# Altium schematic sheet LED Readout Resistors.SchDoc
size B
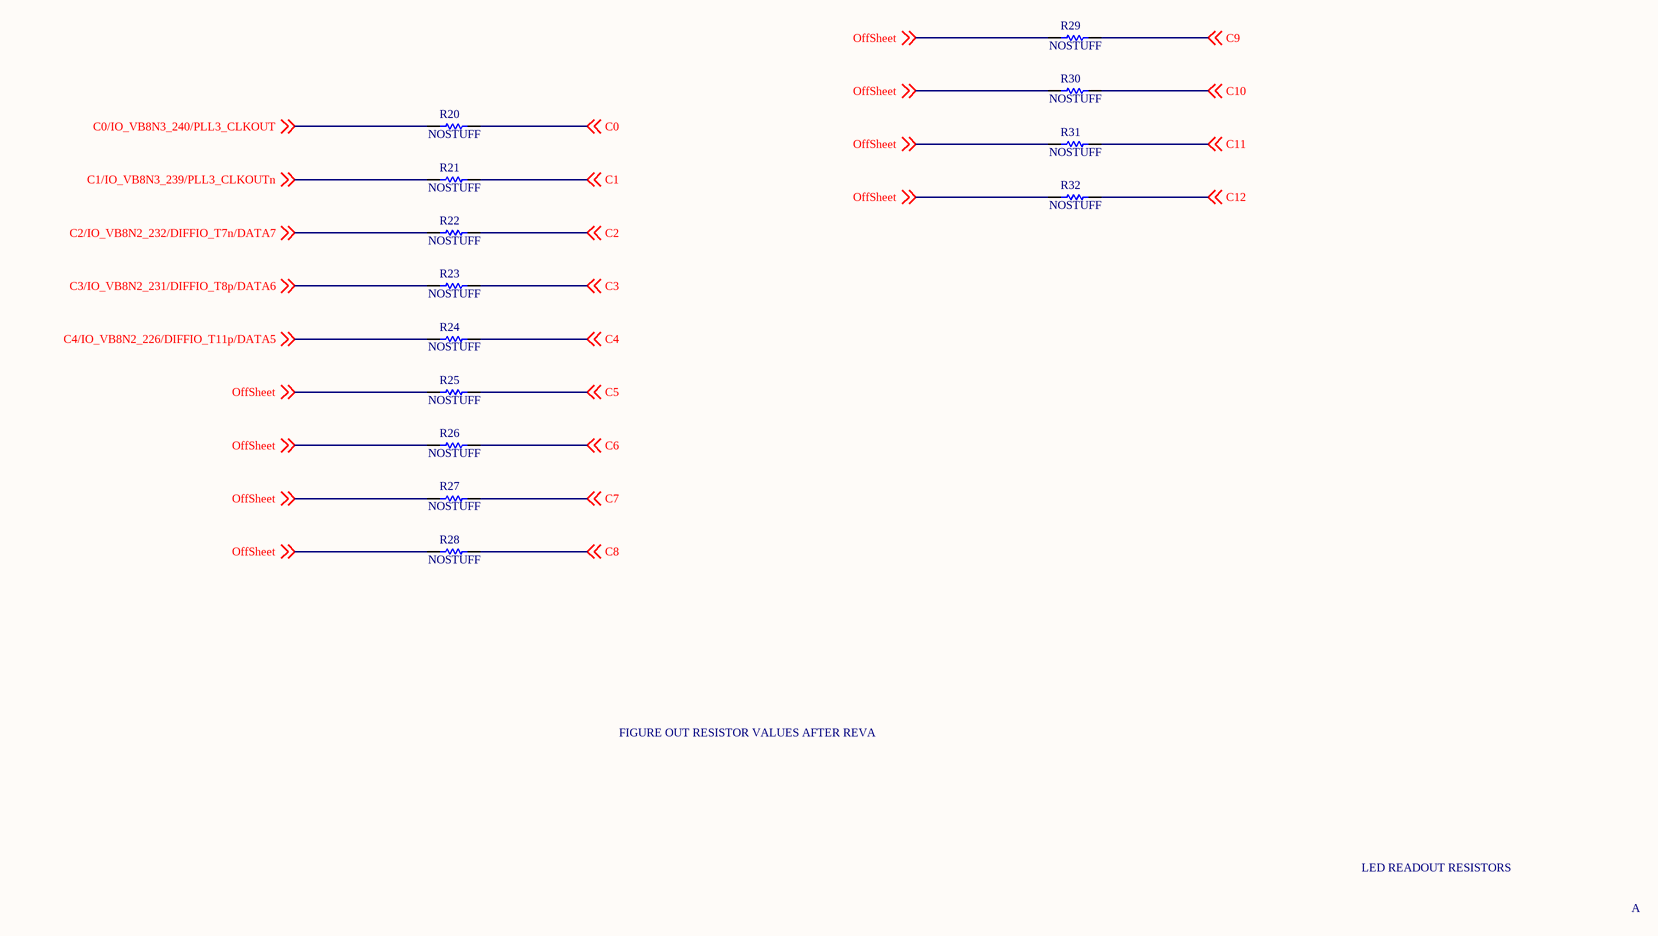
[diagram p0: LED Readout Resistors.SchDoc]

## Parts
R20  value NOSTUFF  [RES_0603]  (hidden comment: Figure out ohmage after RevA)
R21  value NOSTUFF  [RES_0603]  (hidden comment: Figure out ohmage after RevA)
R22  value NOSTUFF  [RES_0603]  (hidden comment: Figure out ohmage after RevA)
R23  value NOSTUFF  [RES_0603]  (hidden comment: Figure out ohmage after RevA)
R24  value NOSTUFF  [RES_0603]  (hidden comment: Figure out ohmage after RevA)
R25  value NOSTUFF  [RES_0603]  (hidden comment: Figure out ohmage after RevA)
R26  value NOSTUFF  [RES_0603]  (hidden comment: Figure out ohmage after RevA)
R27  value NOSTUFF  [RES_0603]  (hidden comment: Figure out ohmage after RevA)
R28  value NOSTUFF  [RES_0603]  (hidden comment: Figure out ohmage after RevA)
R29  value NOSTUFF  [RES_0603]  (hidden comment: Figure out ohmage after RevA)
R30  value NOSTUFF  [RES_0603]  (hidden comment: Figure out ohmage after RevA)
R31  value NOSTUFF  [RES_0603]  (hidden comment: Figure out ohmage after RevA)
R32  value NOSTUFF  [RES_0603]  (hidden comment: Figure out ohmage after RevA)

## Nets
C0: R20.2 ; off-sheet C0
C0/IO_VB8N3_240/PLL3_CLKOUT: R20.1 ; off-sheet C0/IO_VB8N3_240/PLL3_CLKOUT
C1: R21.2 ; off-sheet C1
C1/IO_VB8N3_239/PLL3_CLKOUTn: R21.1 ; off-sheet C1/IO_VB8N3_239/PLL3_CLKOUTn
C2: R22.2 ; off-sheet C2
C2/IO_VB8N2_232/DIFFIO_T7n/DATA7: R22.1 ; off-sheet C2/IO_VB8N2_232/DIFFIO_T7n/DATA7
C3: R23.2 ; off-sheet C3
C3/IO_VB8N2_231/DIFFIO_T8p/DATA6: R23.1 ; off-sheet C3/IO_VB8N2_231/DIFFIO_T8p/DATA6
C4: R24.2 ; off-sheet C4
C4/IO_VB8N2_226/DIFFIO_T11p/DATA5: R24.1 ; off-sheet C4/IO_VB8N2_226/DIFFIO_T11p/DATA5
C5: R25.2 ; off-sheet C5
C6: R26.2 ; off-sheet C6
C7: R27.2 ; off-sheet C7
C8: R28.2 ; off-sheet C8
C9: R29.2 ; off-sheet C9
C10: R30.2 ; off-sheet C10
C11: R31.2 ; off-sheet C11
C12: R32.2 ; off-sheet C12
OffSheet: R25.1 R26.1 R27.1 R28.1 R29.1 R30.1 R31.1 R32.1 ; off-sheet OffSheet

## Notes on the sheet
- FIGURE OUT RESISTOR VALUES AFTER REVA
- LED READOUT RESISTORS
- A

## Library data of the parts
R20-R32 = Res1: Resistor; Published: 8-Jun-2000; LatestRevisionDate: 17-Jul-2002; LatestRevisionNote: Re-released for DXP Platform.; PackageReference: AXIAL-0.3; Publisher: Altium Limited; PackageDescription: Axial Device, Thru-Hole; 2 Leads; 0.3 in Pin Spacing